# EAGLE design litebrite2.3 (EAGLE 6.5.0)
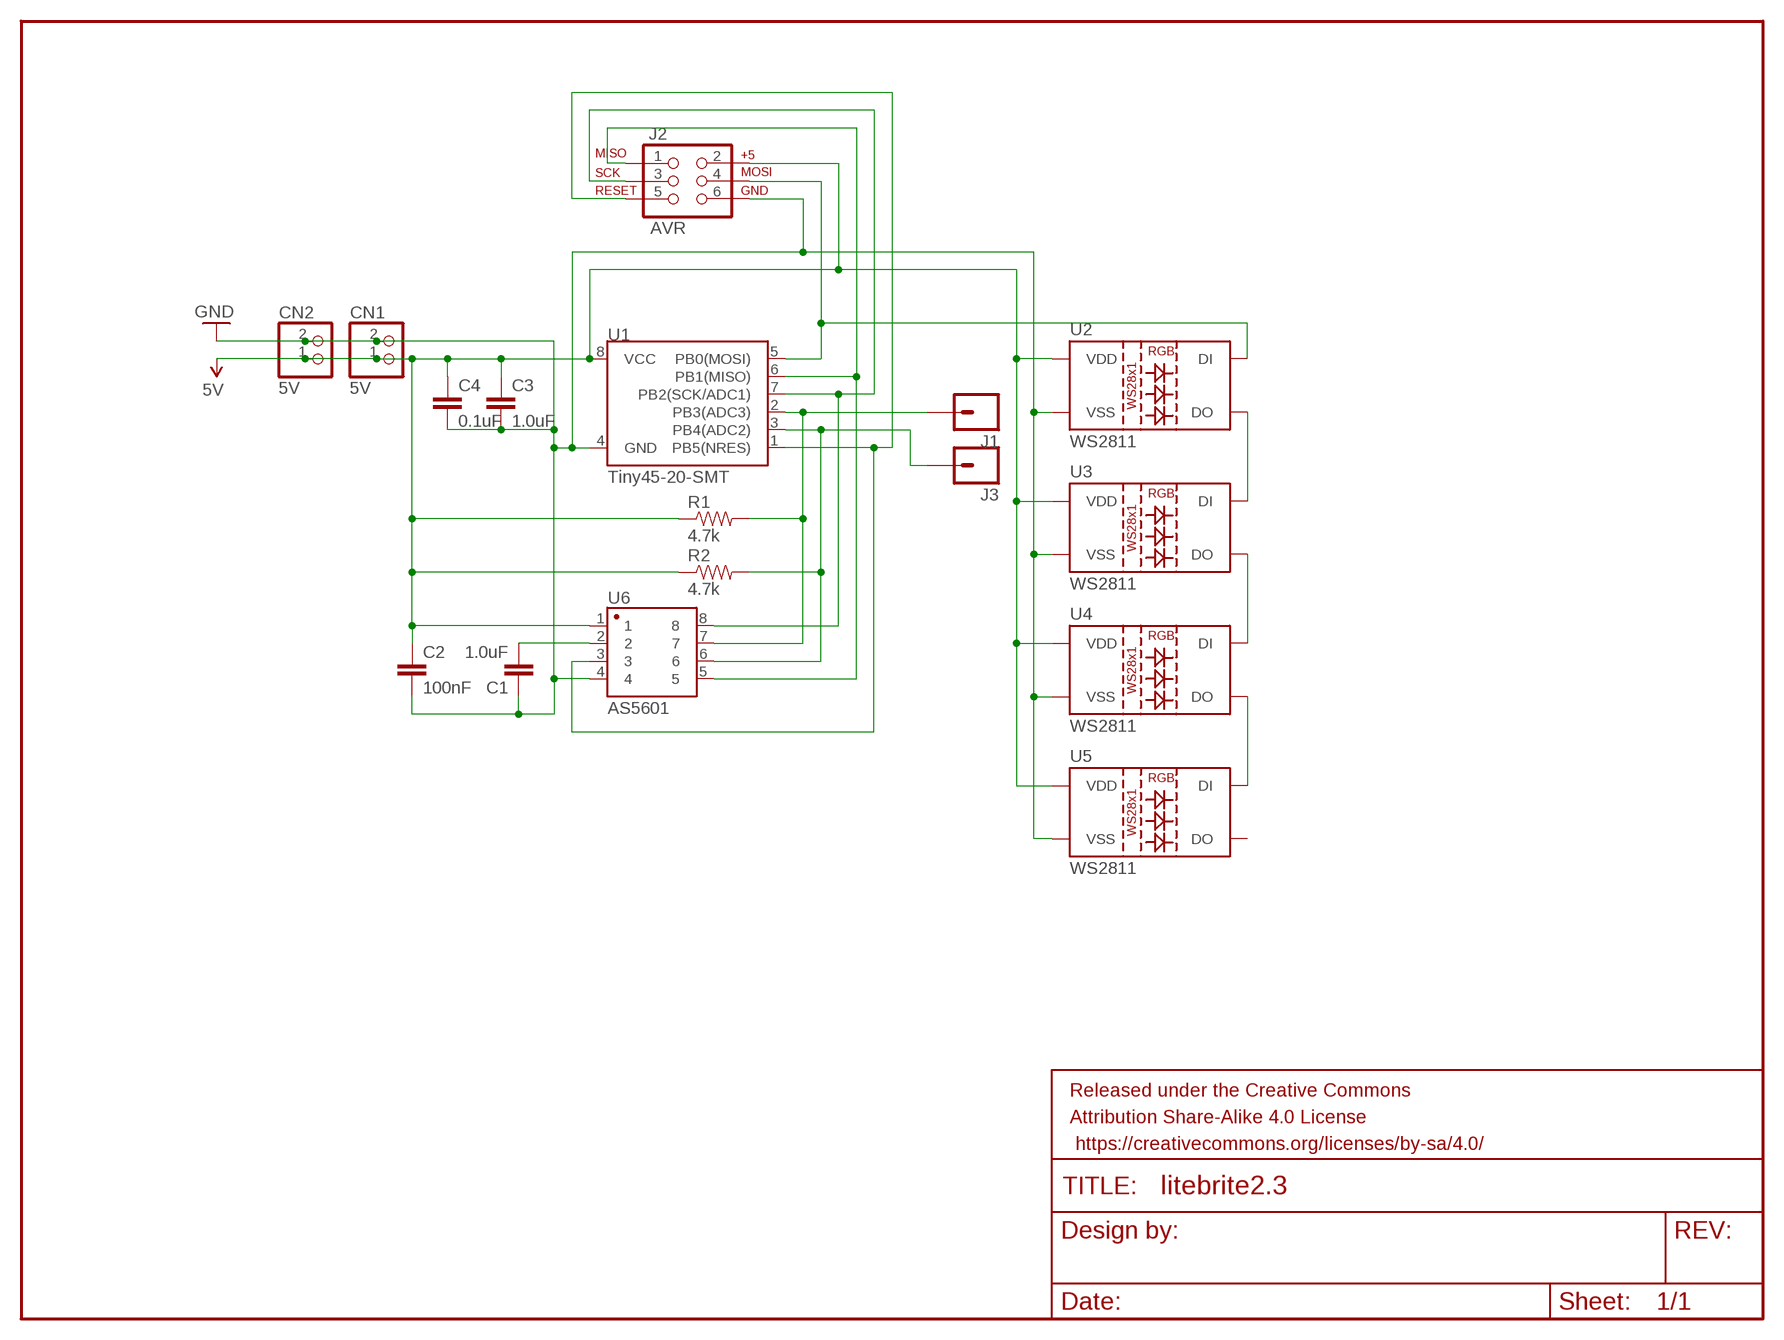
[diagram p0: schematic, sheet 1]

## Parts
C1  1.0uF  1.0UF-16V-10%(0402)  [0402-CAP]
C2  100nF  CAP0402-CAP  [0402-CAP]
C3  1.0uF  1.0UF-16V-10%(0402)  [0402-CAP]
C4  0.1uF  0.1UF-16V(+-10%)(0402)  [0402-CAP]
CN1  5V  JST_2PIN-SMT-RA  [JST-PH-2-SMT-RA]
CN2  5V  JST_2PIN-SMT-RA  [JST-PH-2-SMT-RA]
FRAME1  FRAME-LETTERNO_PACKAGE  [DUMMY]
J1  M01SMD  [LUXEON-PAD]
J2  AVR  AVR_SPI_PRG_6PTH  [2X3]
J3  M01SMD  [LUXEON-PAD]
R1  4.7k  4.7OHM-1/10W-5%(0603)  [0603-RES]
R2  4.7k  4.7OHM-1/10W-5%(0603)  [0603-RES]
U1  Tiny45-20-SMT  ATTINY45TINY45-20-SMT  [SO08-EIAJ]
U2  WS2811  LED-TRICOLOR-5050-ICWS2811  [LED-TRICOLOR-5050-IC]
U3  WS2811  LED-TRICOLOR-5050-ICWS2811  [LED-TRICOLOR-5050-IC]
U4  WS2811  LED-TRICOLOR-5050-ICWS2811  [LED-TRICOLOR-5050-IC]
U5  WS2811  LED-TRICOLOR-5050-ICWS2811  [LED-TRICOLOR-5050-IC]
U6  AS5601  GENERIC-SOIC8MSGEQ7N-FILTER  [SO08]

## Nets
5V: C2.1 C3.1 C4.1 CN1.1 CN2.1 J2.2 R1.1 R2.1 U1.8(VCC) U2.3(VDD) U2.5(VDD) U3.3(VDD) U3.5(VDD) U4.3(VDD) U4.5(VDD) U5.3(VDD) U5.5(VDD) U6.1
GND: C1.1 C2.2 C3.2 C4.2 CN1.2 CN2.2 J2.6 U1.4(GND) U2.6(VSS) U3.6(VSS) U4.6(VSS) U5.6(VSS) U6.4
N$1: U2.1(DO) U3.2(DI)
N$2: U3.1(DO) U4.2(DI)
N$3: U4.1(DO) U5.2(DI)
N$4: J2.4 U1.5(PB0(MOSI)) U2.2(DI)
N$5: J3.P$1 R2.2 U1.3(PB4(ADC2)) U6.6
N$6: J1.P$1 R1.2 U1.2(PB3(ADC3)) U6.7
N$7: J2.3 U1.7(PB2(SCK/ADC1)) U6.8
N$8: J2.1 U1.6(PB1(MISO)) U6.5
N$9: J2.5 U1.1(PB5(NRES)) U6.3
N$10: C1.2 U6.2
Unconnected: U5.1(DO)

## Library data of the parts
C1 C3 = SparkFun-Capacitors:1.0UF-16V-10%(0402); PROD_ID: CAP-12417
C2 = SparkFun-Capacitors:CAP: Capacitor Standard 0603 ceramic capacitor, and 0.1" leaded capacitor.
C4 = SparkFun-Capacitors:0.1UF-16V(+-10%)(0402); PROD_ID: CAP-12416
CN1 CN2 = adafruit:JST_2PIN: JST 2-Pin Connectors of various flavors SMT-RA (S2B-PH-SM4) 4UConnector #17311 SMT (B2B-PH-SM4) THM-RA (S2B-PH) THM (B2B-PH)
FRAME1 = SparkFun-Aesthetics:FRAME-LETTER: Schematic Frame Standard 8.5x11 US Letter frame; DESIGNER: Nobody; VERSION: v01
J1 J3 = SparkFun-Connectors:M01: Header 1 Standard 1-pin 0.1" header. Use with straight break away headers (SKU : PRT-00116), right angle break away headers (PRT-00553), swiss pins (PRT-00743), machine pins (PRT-00117), and female headers (PRT-00115). SMTSO-256-ET is a "flush mount" nut for a 4-40 screw. The older package used to be too tight, and did not allow it to sit properly thru the drill hit. The latest (0.165DIA) fits nice and snug.
J2 = SparkFun-Connectors:AVR_SPI_PRG_6: AVR ISP 6 Pin This is the reduced ISP connector for AVR programming. Common on Arduino. This footprint will take up less PCB space and can be used with a 10-pin to 6-pin adapter such as SKU: BOB-08508 **Special note about "TEST_POINT" package. The stop mask is on the top side, so if you want your programming test points to be on the bottom of your board, make sure to place this package on the bottom side of the board. This also ensure that the orientation to program from the bottom side will be correct.
R1 R2 = SparkFun-Resistors:4.7OHM-1/10W-5%(0603): RES-08295; PROD_ID: RES-08295
U1 = SparkFun-DigitalIC:ATTINY45: Atmel 8-pin 2/4/8kB flash uC; PROD_ID: IC-08922
U2-U5 = SparkFun-LED:LED-TRICOLOR-5050-IC: WS2812 RGB LED w/ WS2811 driver 5x5mm SMD LED with built-in controller IC. DIO-11598; PROD_ID: DIO-11598
U6 = SparkFun-AnalogIC:GENERIC-SOIC8: A placeholder for generic narrow & wide SOIC8 foorptints - used on the DIP adapter board.; PROD_ID: IC-10141

## Board
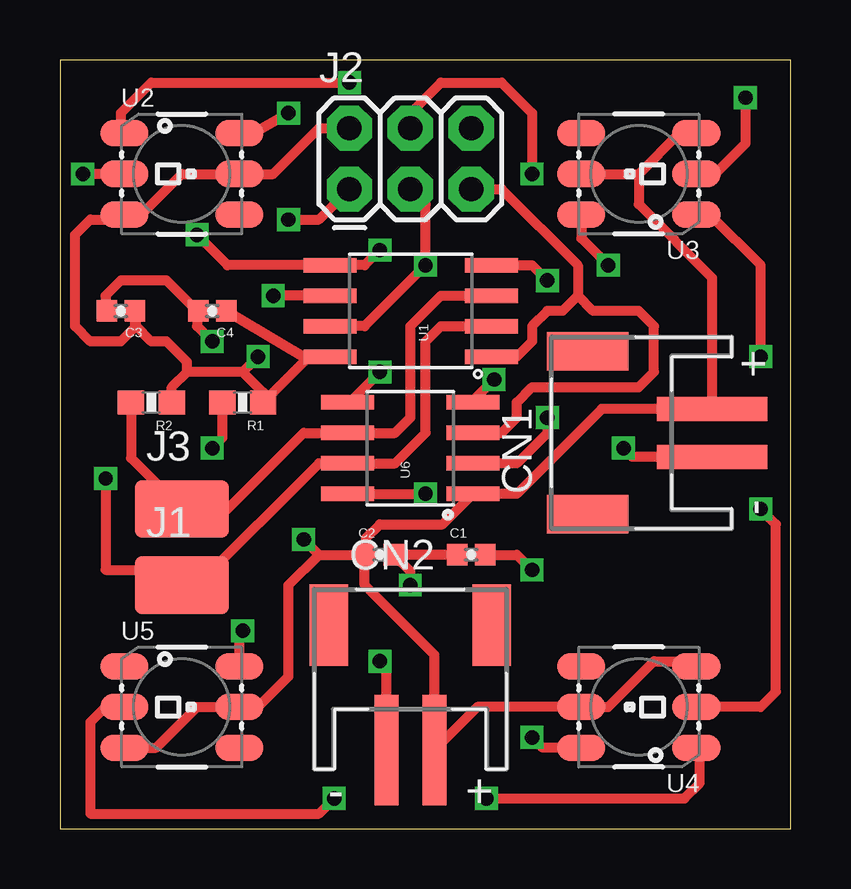
[diagram p1: board, top side]
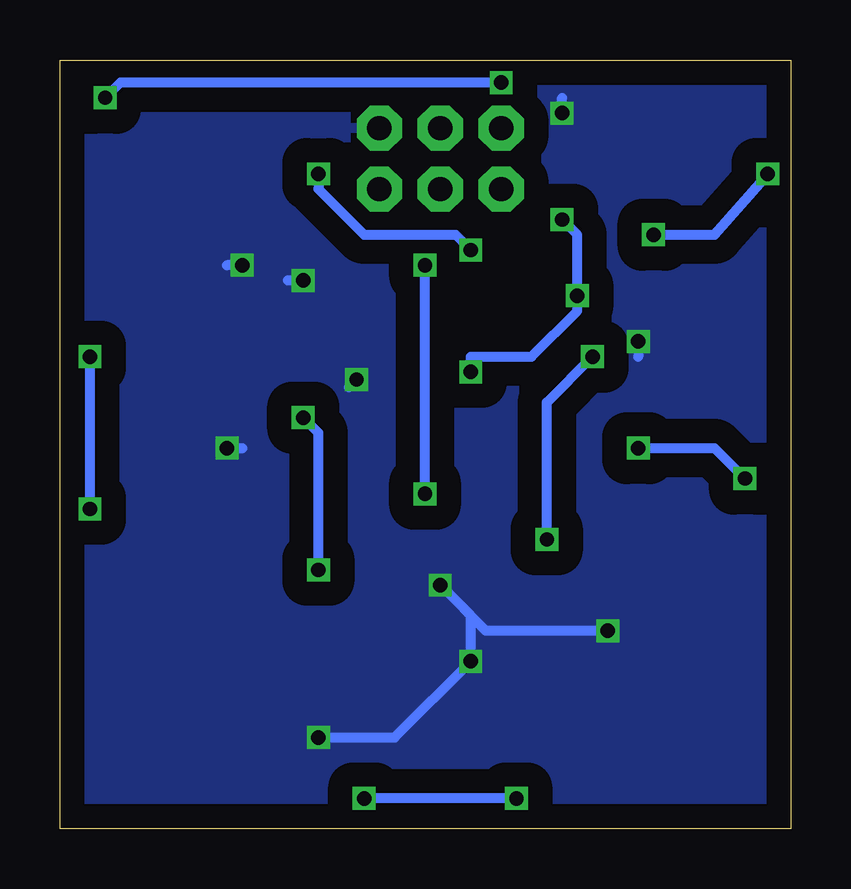
[diagram p2: board, bottom side, seen from below]

Size 30.46 x 32.05 mm. Coordinates in mm from the lower left corner, seen from the top.
Outline: 0,0 30.46,0 30.46,32.05 0,32.05 0,0
Copper layers (1*16): Top 0.0356mm / dielectric 1.5011mm / Bottom 0.0356mm
Design rules "LaenPCBOrder": minimum track width 6mil, minimum drill 13mil, track to track 6mil, track to pad 6mil, pad to pad 6mil, via to via 6mil, smd to smd 6mil, copper to edge 15mil, drill to drill 6mil, minimum pad ring 7mil, minimum via ring 7mil, stop-mask expansion 3mil, vias tented up to drill 0mil, thermal gap 10mil

### Footprints (pad centres in the part's own frame; a part is rotated, then mirrored left to right if it is on the bottom)
0402-CAP = smd 0.85 x 0.9: 1 -0.58,0; 2 0.58,0
JST-PH-2-SMT-RA = smd 1 x 4.6: 1 1,-3.7; 2 -1,-3.7 | smd 1.6 x 3.4: NC1 -3.4,1.5; NC2 3.4,1.5
LUXEON-PAD = smd 3.9 x 2.4: P$1 0,0
2X3 = drill 1.016 pad 1.88 octagon: 1 0,0; 2 0,2.54; 3 2.54,0; 4 2.54,2.54; 5 5.08,0; 6 5.08,2.54
0603-RES = smd 1.1 x 1: 1 -0.85,0; 2 0.85,0
SO08-EIAJ = smd 0.61 x 2.21: 1 -1.905,-3.378; 2 -0.635,-3.378; 3 0.635,-3.378; 4 1.905,-3.378; 5 1.905,3.353; 6 0.635,3.353; 7 -0.635,3.353; 8 -1.905,3.353
LED-TRICOLOR-5050-IC = smd 2 x 1.1: 1 -2.4,1.7; 2 -2.4,0; 3 -2.4,-1.7; 4 2.4,-1.7; 5 2.4,0; 6 2.4,1.7
SO08 = smd 0.61 x 2.21: 1 -1.905,-2.616; 2 -0.635,-2.616; 3 0.635,-2.616; 4 1.905,-2.616; 5 1.905,2.616; 6 0.635,2.616; 7 -0.635,2.616; 8 -1.905,2.616

### Placement (x,y rotation side)
C1  17.14,11.43 0 top
C2  13.34,11.43 0 top
C3  2.54,21.59 180 top
C4  6.35,21.59 180 top
CN1  23.5,16.51 90 top
CN2  14.61,6.99 0 top
FRAME1  -13.97,31.75 0 top  (outside the outline)
J1  5.08,10.16 0 top
J2  12.06,26.67 0 top
J3  5.08,13.34 0 top
R1  7.62,17.78 180 top
R2  3.81,17.78 180 top
U1  14.61,21.59 90 top
U2  5.08,27.3 0 top
U3  24.13,27.3 180 top
U4  24.13,5.08 180 top
U5  5.08,5.08 0 top
U6  14.61,15.88 90 top

### Tracks (layer width: path | path; a pad name or v marks a point on that pad's centre or on a via)
5V  (via drill 0.6)
  Top 0.406: U4.3 26.32,6.99 24.77,6.99 22.86,5.08 U4.5 17.4,5.08 CN2.1 15.61,7.25 12.7,10.16 12.7,11.38 C2.1 | C2.1 12.76,12.12 13.34,12.7 15.95,12.7 U6.1 19.05,13.97 22.59,17.51 CN1.1 27.2,22.97 24.13,26.04 24.13,27.3 | U5.3 4.01,3.38 5.71,5.08 U5.5 8.26,5.08 9.53,6.35 9.53,10.16 10.79,11.43 | 10.79,11.43 C2.1 | U3.3 25.83,29 | 25.83,29 24.13,27.3 | C4.1 10.11,19.68 U1.8 10.38,19.68 R1.1 8.47,18.2 7.62,19.05 | R2.1 4.66,18.41 5.29,19.05 | J2.2 10.79,29.21 8.89,27.3 U2.5 5.08,27.3 3.38,25.61 U2.3 2.48,25.4 1.27,25.4 0.64,24.77 0.64,20.95 1.27,20.32 2.54,20.32 3.12,20.9 C3.1 3.17,21.54 3.17,20.95 3.81,20.32 4.45,20.32 5.29,19.47 5.29,19.05 | U3.5 24.13,27.3 | 26.04,29.21 25.83,29 | 7.62,19.05 5.29,19.05 | 10.79,11.43 v10.16,12.06 | v8.26,19.68 7.62,19.05
  Bottom 0.406: v10.16,12.06 10.16,17.78 v8.26,19.68
GND  (via drill 0.6)
  Top 0.406: U5.6 7.48,8.12 v7.62,8.26 | v14.61,10.16 14.61,10.74 C2.2 C1.1 | CN2.2 13.61,6.71 v13.34,6.99 | U4.6 20.11,3.38 v19.68,3.81 | C4.2 5.71,21.59 | C3.2 1.91,21.64 1.91,22.23 2.54,22.86 4.45,22.86 5.71,21.59 | 5.71,21.59 5.71,20.95 v6.35,20.32 | U2.6 8.05,29 v9.53,29.84 | U3.6 21.73,24.62 v22.86,23.5 | CN1.2 23.86,15.51 v23.5,15.88 | U1.4 19.68,23.5 v20.32,22.86 | U6.4 17.22,17.86 v18.1,18.73
  Bottom 0.406: v7.62,8.26 12.7,8.26 v14.61,10.16 13.34,8.89 v13.34,6.99 16.51,3.81 v19.68,3.81 | v6.35,20.32 6.35,19.68 | v9.53,29.84 9.53,30.48 | v22.86,23.5 23.5,23.5 | v23.5,15.88 22.86,15.88 | v20.32,22.86 20.95,22.86 | v18.1,18.73 18.41,18.41
  pour Bottom (isolate 1.016): 0,31.75 30.48,31.75 30.48,0 0,0
N$1  (via drill 0.6)
  Top 0.406: U2.1 2.54,29.14 2.54,29.84 3.81,31.11 v12.06,31.11 | v28.57,30.48 28.57,28.57 27.3,27.3 U3.2
  Bottom 0.406: v12.06,31.11 27.94,31.11 v28.57,30.48
N$2  (via drill 0.6)
  Top 0.406: U3.1 27.1,25.61 29.21,23.5 v29.21,19.68 | U4.2 29.21,5.08 29.84,5.71 29.84,12.7 v29.21,13.34
  Bottom 0.406: v29.21,13.34 v29.21,19.68
N$3  (via drill 0.6)
  Top 0.406: U5.2 1.91,5.08 1.27,4.45 1.27,0.64 10.79,0.64 v11.43,1.27 | v17.78,1.27 26.04,1.27 26.67,1.91 26.67,3.24 U4.1
  Bottom 0.406: v11.43,1.27 v17.78,1.27
N$4  (via drill 0.6)
  Top 0.406: v5.71,24.77 6.99,23.5 U1.5 12.7,23.5 v13.34,24.13 | U2.2 v0.95,27.3 | J2.4 14.61,29.84 15.88,31.11 18.41,31.11 19.68,29.84 v19.68,27.3
  Bottom 0.406: v5.71,24.77 3.17,24.77 v0.95,27.3 | v19.68,27.3 19.68,26.67 17.78,24.77 13.97,24.77 v13.34,24.13
N$5
  Top 0.406: U1.3 15.88,22.23 14.61,20.95 14.61,17.14 13.97,16.51 U6.6 10.16,16.51 6.99,13.34 J3.P$1 2.96,15.46 R2.2
N$6  (via drill 0.6)
  Top 0.406: U1.2 15.88,20.95 15.24,20.32 15.24,16.51 13.97,15.24 U6.7 10.79,15.24 5.71,10.16 J1.P$1 4.45,10.79 1.91,10.79 v1.91,14.61 | R1.2 6.77,16.3 v6.35,15.88
  Bottom 0.406: v6.35,15.88 3.17,15.88 v1.91,14.61
N$7  (via drill 0.6)
  Top 0.406: U6.8 v15.24,13.97 | J2.3 15.24,26.04 v15.24,23.5 12.7,20.95 U1.7
  Bottom 0.406: v15.24,13.97 v15.24,23.5
N$8  (via drill 0.6)
  Top 0.406: 11.43,22.23 U1.6 v8.89,22.23 | v9.53,25.4 10.79,25.4 J2.1 | U6.5 12.06,17.78 v13.34,19.05
  Bottom 0.406: v9.53,25.4 8.89,24.77 v8.89,22.23 8.89,21.59 10.79,19.68 13.34,19.68 v13.34,19.05
N$9
  Top 0.406: 18.41,19.68 U1.1 19.05,19.68 19.68,20.32 19.68,20.95 20.32,21.59 20.95,21.59 21.59,22.23 | J2.5 18.41,26.67 21.59,23.5 21.59,22.23 | U6.3 18.41,16.51 19.05,17.14 19.05,17.78 19.68,18.41 24.13,18.41 24.77,19.05 24.77,20.95 24.13,21.59 22.23,21.59 21.59,22.23
N$10  (via drill 0.6)
  Top 0.406: C1.2 19.05,11.43 v19.68,10.79 | v20.32,17.14 20.32,16.51 19.05,15.24 U6.2
  Bottom 0.406: v19.68,10.79 19.68,16.51 v20.32,17.14